# EasyEDA schematic RC2014- Interface E- V1.1.json
TITLE: RC2014 Kempston Interface E; REV: 1.1; Date: 10-07-2023; Sheet: 1/1; Company: --
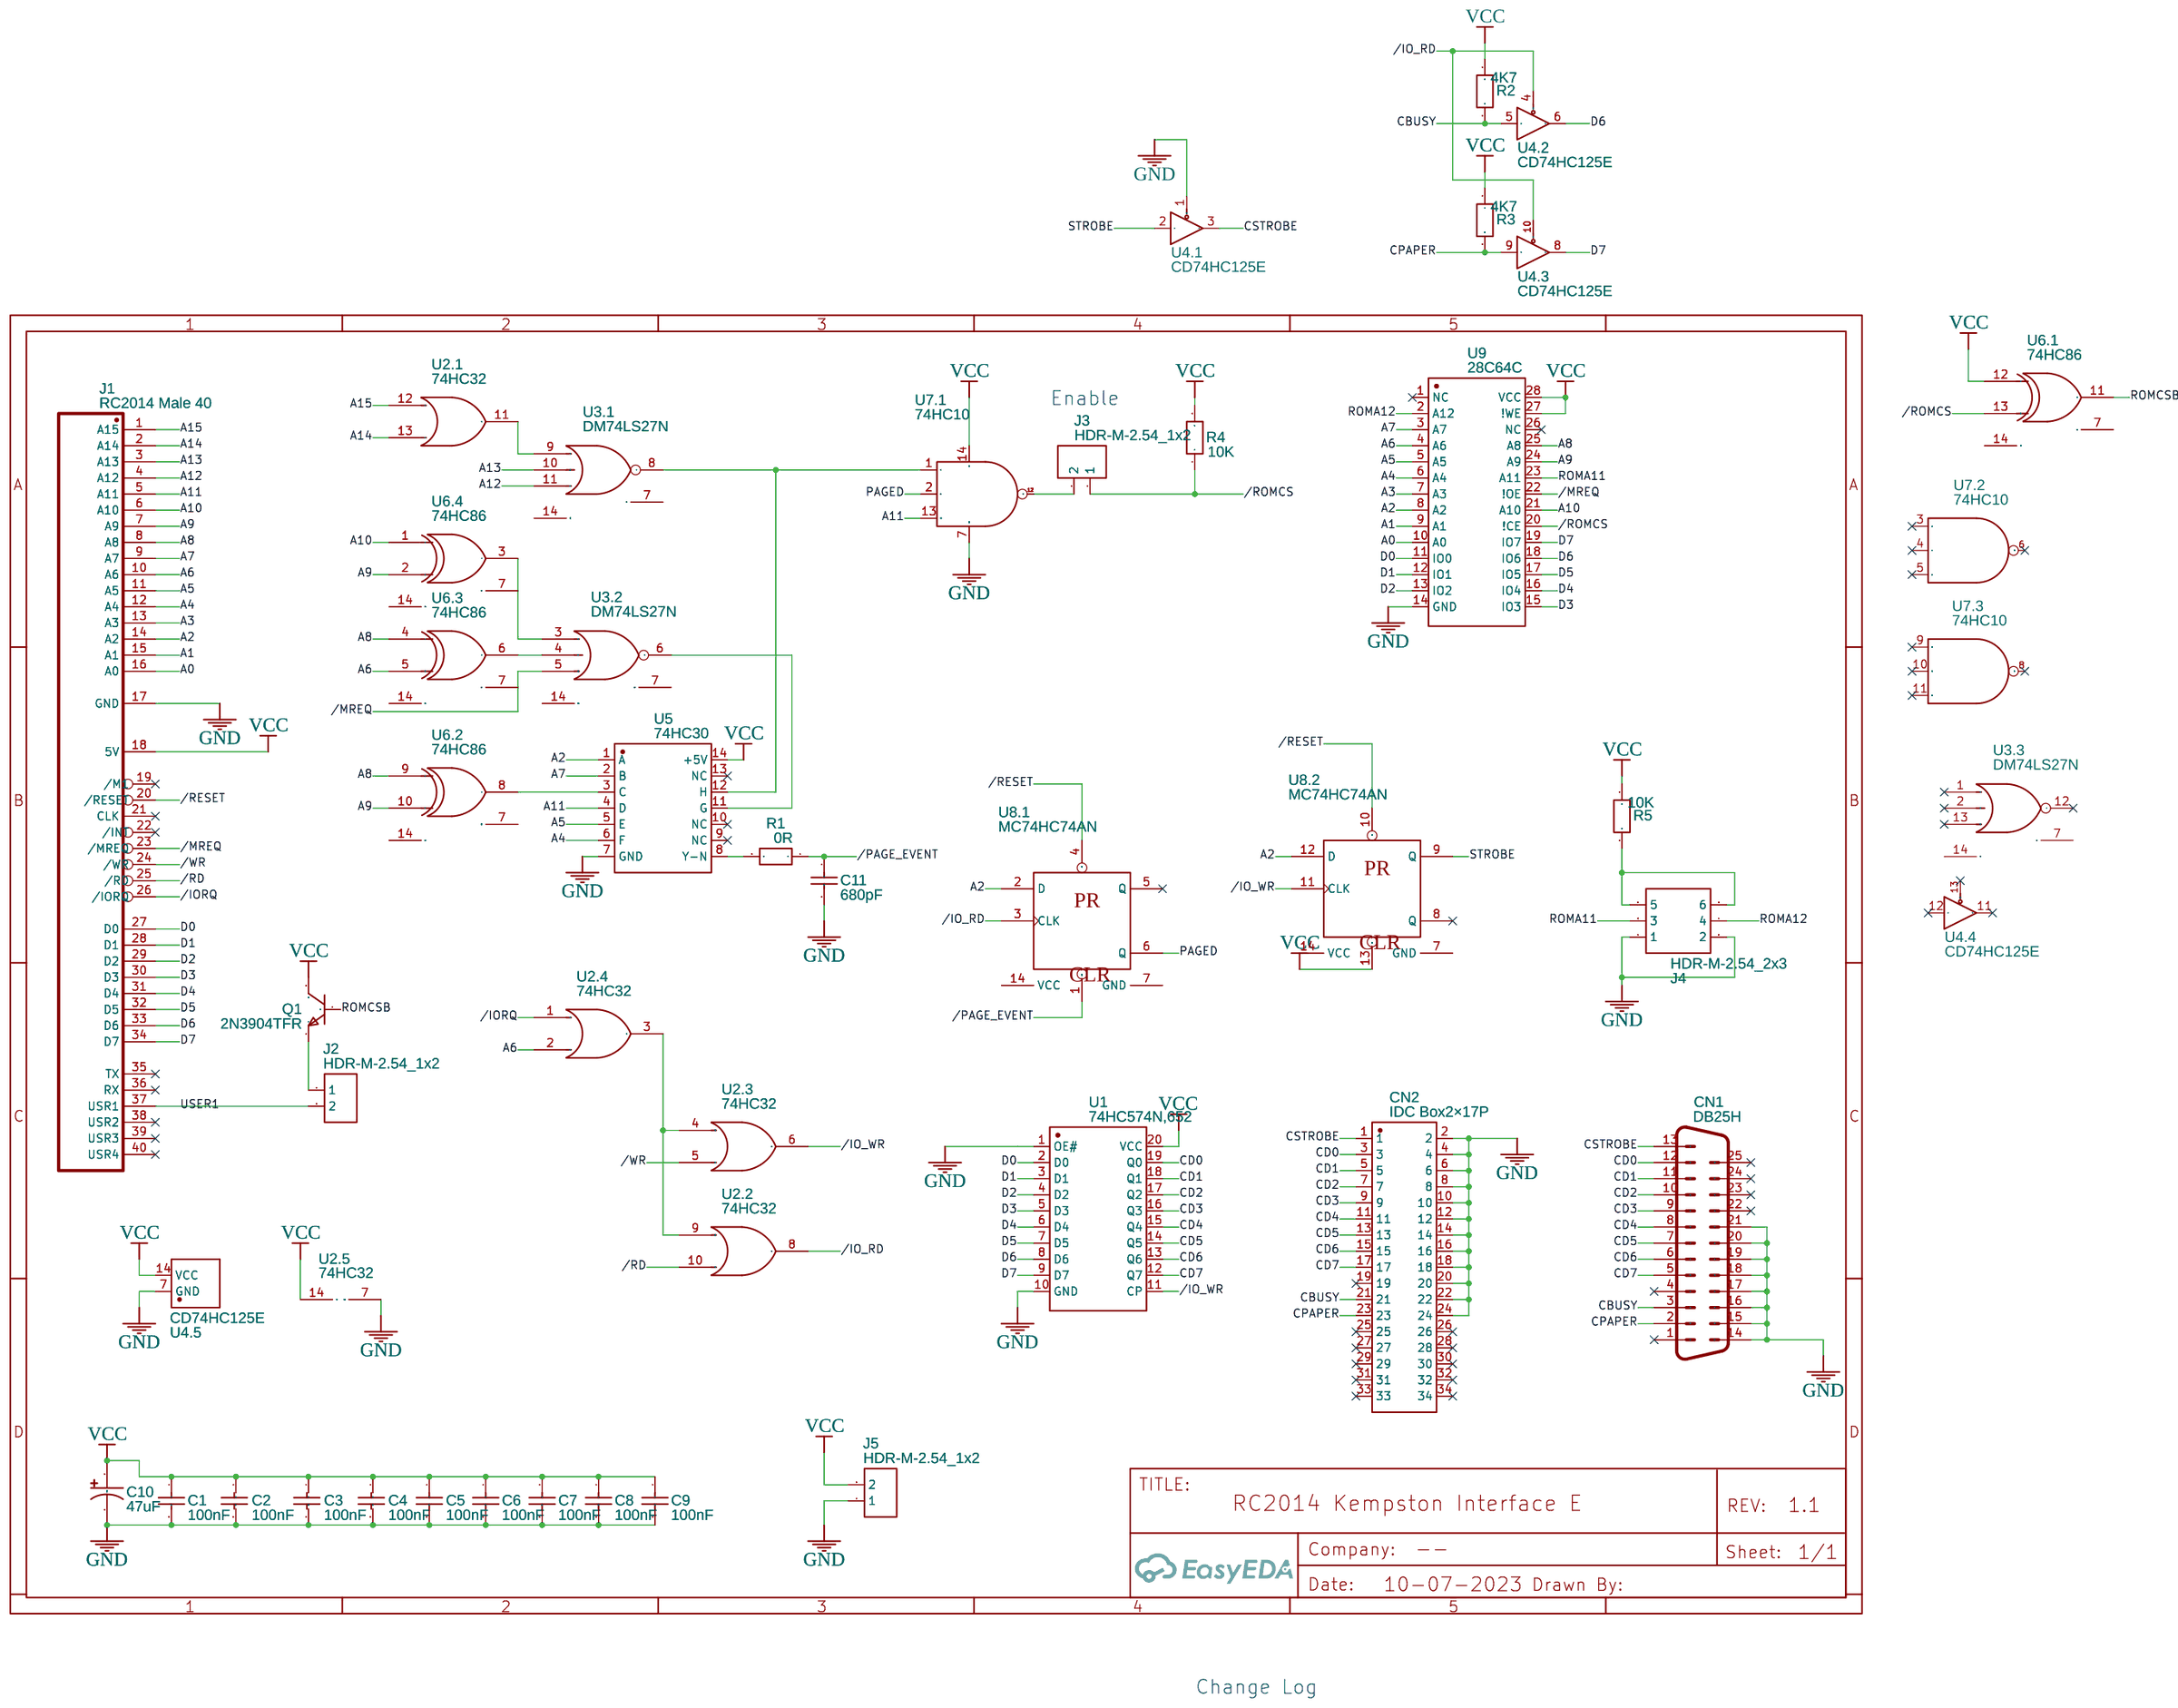
[diagram p0: schematic sheet]

## Parts
C1  100nF  [CAP-TH_L5.5-W3.5-P2.50-D0.5 COPY]
C2  100nF  [CAP-TH_L5.5-W3.5-P2.50-D0.5 COPY]
C3  100nF  [CAP-TH_L5.5-W3.5-P2.50-D0.5 COPY]
C4  100nF  [CAP-TH_L5.5-W3.5-P2.50-D0.5 COPY]
C5  100nF  [CAP-TH_L5.5-W3.5-P2.50-D0.5 COPY]
C6  100nF  [CAP-TH_L5.5-W3.5-P2.50-D0.5 COPY]
C7  100nF  [CAP-TH_L5.5-W3.5-P2.50-D0.5 COPY]
C8  100nF  [CAP-TH_L5.5-W3.5-P2.50-D0.5 COPY]
C9  100nF  [CAP-TH_L5.5-W3.5-P2.50-D0.5 COPY]
C10  47uF  [CAP-TH_BD6.3-P2.50-D1.0-FD]
C11  680pF  [CAP-TH_L5.5-W3.5-P2.50-D0.5 COPY]
CN1  DB25H  [M25H]
CN2  IDC Box2×17P  [IDC-TH_34P-P2.54_BOOMELE-2X17P]
J1  RC2014 Male 40  [HDR-1X40-A-M-R-2.54MM]
J2  HDR-M-2.54_1x2  [HDR-M-2.54_1X2]
J3  HDR-M-2.54_1x2  [HDR-M-2.54_1X2]
J4  HDR-M-2.54_2x3  [HDR-M-2.54_2X3]
J5  HDR-M-2.54_1x2  [HDR-M-2.54_1X2]
Q1  2N3904TFR  [TO-92-3_L4.8-W3.7-P2.54-L]
R1  0R  [R_AXIAL-0.3]
R2  4K7  [R_AXIAL-0.3]
R3  4K7  [R_AXIAL-0.3]
R4  10K  [R_AXIAL-0.3]
R5  10K  [R_AXIAL-0.3]
U1  74HC574N,652  [DIP-20_L26.8-W6.4-P2.54-LS7.6-BL]
U2  74HC32  [DIP14]  (sections 1,2,3,4,5)
U3  DM74LS27N  [DIP14]  (sections 1,2,3)
U4  CD74HC125E  [PDIP-14_L19.3-W6.4-P2.54-LS7.9-BL-1]  (sections 1,2,3,4,5)
U5  74HC30  [DIP14]
U6  74HC86  [DIP14]  (sections 1,2,3,4)
U7  74HC10  [DIP14]  (sections 1,2,3)
U8  MC74HC74AN  [DIP14]  (sections 1,2)
U9  28C64C  [DIP28-600]

## Library data of the parts
C1-C9 C11 = 100nF (104) ±20% 100V: Supplier: LCSC; Manufacturer: ReliaPro; Supplier Part: C72322
C10 = KM1H470ME110A00CV0: Supplier: LCSC; Supplier Part: C190654; Manufacturer: Changzhou Huawei Elec; Contributor: LCSC; JLCPCB Part Class: Extended Part
CN1 = DB25H: Various DB25 connectors; Contributor: SparkFun
CN2 = IDC Box2×17P: Supplier: LCSC; Manufacturer: BOOMELE; Manufacturer Part: IDC Box2×17P Right Angle; Supplier Part: C20920; JLCPCB Part Class: Extended Part
J1 = RC2014 Male 40
J2 J3 J5 = HDR-M-2.54_1x2: Supplier Part: C124375; Supplier: LCSC; Contributor: LCEDA_Lib
J4 = HDR-M-2.54_2x3: Supplier Part: C65114; Supplier: LCSC; Contributor: LCEDA_Lib
Q1 = 2N3904TFR: Supplier: LCSC; Supplier Part: C258185; Manufacturer: ON Semicon; Contributor: LCSC; JLCPCB Part Class: Extended Part
R1-R5 = R_AXIAL-0.3_EU: Contributor: LCEDA_Lib
U1 = 74HC574N,652: Supplier: LCSC; Manufacturer: Nexperia; Supplier Part: C5347
U2 = 74HC32: Quad 2-Input OR Gates; subpart_no: 1
U3 U6 = 74HC86: Quad 2-Input XOR Gate; subpart_no: 1
U4 = CD74HC125E: Supplier: LCSC; Supplier Part: C1548119; Manufacturer: TI(德州仪器); subpart_no: 1
U5 = 74HC30: Supplier: LCSC; Supplier Part: C133818; Manufacturer: Texas Instruments; Manufacturer Part: CD74HC30E; Contributor: LCSC
U7 = 74HC10: Supplier: Digi-Key; Contributor: xjplguy; subpart_no: 1
U8 = MC74HC74AN: Dual D-Type Flip-Flop with Set and Reset; subpart_no: 1
U9 = 28C64C

## Nets
GND: C1.2 C2.2 C3.2 C4.2 C5.2 C6.2 C7.2 C8.2 C9.2 C10.2 C11.2 CN1.14 CN1.15 CN1.16 CN1.17 CN1.18 CN1.19 CN1.20 CN1.21 CN2.2 CN2.4 CN2.6 CN2.8 CN2.10 CN2.12 CN2.14 CN2.16 CN2.18 CN2.20 CN2.22 CN2.24 J1.17(GND) J4.1 J4.2 J5.1 U1.1(OE#) U1.10(GND) U2.7(GND) U4.1(OE) U4.7(GND) U5.7(GND) U7.7(GND) U9.14(GND)
VCC: C1.1 C2.1 C3.1 C4.1 C5.1 C6.1 C7.1 C8.1 C9.1 C10.1 J1.18(5V) J5.2 Q1.3(C) R2.1 R3.1 R4.2 R5.1 U1.20(VCC) U2.14(+5) U4.14(VCC) U5.14(+5V) U6.12(A) U7.14(+5V) U8.13(CLR) U9.27(!WE) U9.28(VCC)
/IO_RD: U2.8(3Y) U4.4(OE) U4.10(OE) U8.3(CLK)
/IO_WR: U1.11(CP) U2.6(2Y) U8.11(CLK)
/IORQ: J1.26(/IORQ) U2.1(1A)
/MREQ: J1.23(/MREQ) U3.5(C) U9.22(!OE)
/PAGE_EVENT: C11.1 R1.1 U8.1(CLR)
/RD: J1.25(/RD) U2.10(3B)
/RESET: J1.20(/RESET) U8.4(PR) U8.10(PR)
/ROMCS: J3.1 R4.1 U6.13(B) U9.20(!CE)
/WR: J1.24(/WR) U2.5(2B)
A0: J1.16(A0) U9.10(A0)
A1: J1.15(A1) U9.9(A1)
A2: J1.14(A2) U5.1(A) U8.2(D) U8.12(D) U9.8(A2)
A3: J1.13(A3) U9.7(A3)
A4: J1.12(A4) U5.6(F) U9.6(A4)
A5: J1.11(A5) U5.5(E) U9.5(A5)
A6: J1.10(A6) U2.2(1B) U6.5(B) U9.4(A6)
A7: J1.9(A7) U5.2(B) U9.3(A7)
A8: J1.8(A8) U6.4(A) U6.9(A) U9.25(A8)
A9: J1.7(A9) U6.2(B) U6.10(B) U9.24(A9)
A10: J1.6(A10) U6.1(A) U9.21(A10)
A11: J1.5(A11) U5.4(D) U7.13
A12: J1.4(A12) U3.11(C)
A13: J1.3(A13) U3.10(B)
A14: J1.2(A14) U2.13(4B)
A15: J1.1(A15) U2.12(4A)
CBUSY: CN1.3 CN2.21 R2.2 U4.5(A)
CD0: CN1.12 CN2.3 U1.19(Q0)
CD1: CN1.11 CN2.5 U1.18(Q1)
CD2: CN1.10 CN2.7 U1.17(Q2)
CD3: CN1.9 CN2.9 U1.16(Q3)
CD4: CN1.8 CN2.11 U1.15(Q4)
CD5: CN1.7 CN2.13 U1.14(Q5)
CD6: CN1.6 CN2.15 U1.13(Q6)
CD7: CN1.5 CN2.17 U1.12(Q7)
CPAPER: CN1.2 CN2.23 R3.2 U4.9(A)
CSTROBE: CN1.13 CN2.1 U4.3(Y)
D0: J1.27(D0) U1.2(D0) U9.11(IO0)
D1: J1.28(D1) U1.3(D1) U9.12(IO1)
D2: J1.29(D2) U1.4(D2) U9.13(IO2)
D3: J1.30(D3) U1.5(D3) U9.15(IO3)
D4: J1.31(D4) U1.6(D4) U9.16(IO4)
D5: J1.32(D5) U1.7(D5) U9.17(IO5)
D6: J1.33(D6) U1.8(D6) U4.6(Y) U9.18(IO6)
D7: J1.34(D7) U1.9(D7) U4.8(Y) U9.19(IO7)
PAGED: U7.2 U8.6(Q)
ROMA11: J4.3 U9.23(A11)
ROMA12: J4.4 U9.2(A12)
ROMCSB: Q1.2(B) U6.11(Y)
STROBE: U4.2(A) U8.9(Q)
USER1: J1.37(USR1) J2.2
Net-(J2-1): J2.1 Q1.1(E)
Net-(J3-2): J3.2 U7.12
Net-(J4-5): J4.5 J4.6 R5.2
Net-(R1-2): R1.2 U5.8(Y-N)
Net-(U2.1-11): U2.11(4Y) U3.9(A)
Net-(U2.2-9): U2.3(1Y) U2.4(2A) U2.9(3A)
Net-(U3.1-8): U3.8(Y) U5.12(H) U7.1
Net-(U3.2-3): U3.3(A) U6.3(Y)
Net-(U3.2-4): U3.4(B) U6.6(Y)
Net-(U3.2-6): U3.6(Y) U5.11(G)
Net-(U5-3): U5.3(C) U6.8(Y)

Not connected (* = marked no-connect by the designer): CN1 1* 4* 22* 23* 24* 25*; CN2 19* 25* 26* 27* 28* 29* 30* 31* 32* 33* 34*; J1 19(/M1)* 21(CLK)* 22(/INT)* 35(TX)* 36(RX)* 38(USR2)* 39(USR3)* 40(USR4)*; U3 1(A)* 2(B)* 7(GND) 12(Y)* 13(C)* 14(VCC); U4 11(Y)* 12(A)* 13(OE)*; U5 9(NC)* 10(NC)* 13(NC)*; U6 7(GND) 14(VCC); U7 3* 4* 5* 6* 8* 9* 10* 11*; U8 5(Q)* 7(GND) 8(Q)* 14(VCC); U9 1(NC)* 26(NC)*

## Notes on the sheet
- Enable
- Change Log
- V1.1
- Rotated CN2 to ensure ribbon cable flows without a bend
- V1.1
- Replaced CN1 with the correct footprint
  Removed RP2040 printer data capture module
  Added 5V jumper for wifi printer adapter
- To be fixed in V1.2+
- change CN1 footprint - no mounting holes in V1.1
